# EAGLE design UNO_Shield (EAGLE 9.5.2)
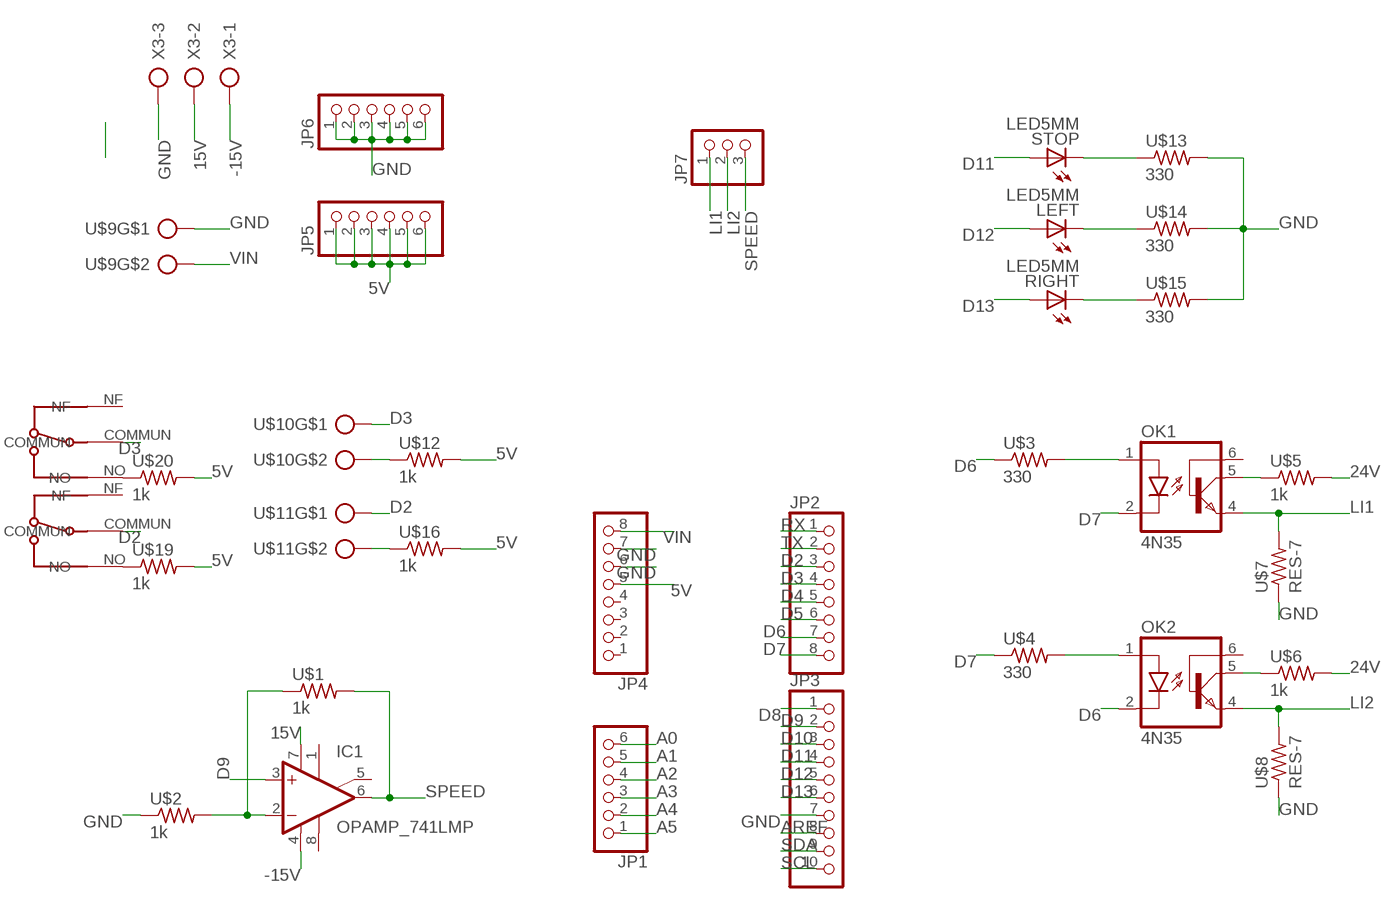
[diagram p0: schematic, sheet 1]

## Parts
IC1  OPAMP_741LMP  [DIL08]
JP1  PINHD-1X6  [1X06]
JP2  PINHD-1X8  [1X08]
JP3  PINHD-1X10  [1X10]
JP4  PINHD-1X8  [1X08]
JP5  PINHD-1X6  [1X06]
JP6  PINHD-1X6  [1X06]
JP7  PINHD-3_DATA  [1X03_DATA]
LEFT  LED5MM  [LED5MM]
OK1  4N35  [DIL06]
OK2  4N35  [DIL06]
RIGHT  LED5MM  [LED5MM]
STOP  LED5MM  [LED5MM]
U$1  1k  RES-7  [0204/7]
U$2  1k  RES-7  [0204/7]
U$3  330  RES-7  [0204/7]
U$4  330  RES-7  [0204/7]
U$5  1k  RES-7  [0204/7]
U$6  1k  RES-7  [0204/7]
U$7  RES-7  [0204/7]
U$8  RES-7  [0204/7]
U$9  CON_PTR_2  [AK300/2]
U$10  CON_PTR_2  [AK300/2]
U$11  CON_PTR_2  [AK300/2]
U$12  1k  RES-7  [0204/7]
U$13  330  RES-7  [0204/7]
U$14  330  RES-7  [0204/7]
U$15  330  RES-7  [0204/7]
U$16  1k  RES-7  [0204/7]
U$17  MICROSWITCHCOUDE  [DG23-B3RA]
U$18  MICROSWITCHCOUDE  [DG23-B3RA]
U$19  1k  RES-7  [0204/7]
U$20  1k  RES-7  [0204/7]
X3  CON_PTR_3  [AK300/3]

## Nets
5V: JP4.5 JP5.1 JP5.2 JP5.3 JP5.4 JP5.5 JP5.6 U$12.2 U$16.2 U$19.2 U$20.2
15V: IC1.7(V+) X3.2
24V: U$5.2 U$6.2
-15V: IC1.4(V-) X3.1
A0: JP1.6
A1: JP1.5
A2: JP1.4
A3: JP1.3
A4: JP1.2
A5: JP1.1
AREF: JP3.8
D2: JP2.3 U$11.1 U$18.COMMUN
D3: JP2.4 U$10.1 U$17.COMMUN
D4: JP2.5
D5: JP2.6
D6: JP2.7 OK1.1(A) OK2.2(C) U$3.1 U$3.2
D7: JP2.8 OK1.2(C) OK2.1(A) U$4.1 U$4.2
D8: JP3.1
D9: IC1.3(+IN) JP3.2
D10: JP3.3
D11: JP3.4 STOP.A
D12: JP3.5 LEFT.A
D13: JP3.6 RIGHT.A
GND: JP3.7 JP4.6 JP4.7 JP6.1 JP6.2 JP6.3 JP6.4 JP6.5 JP6.6 U$2.1 U$7.1 U$8.1 U$9.1 U$13.2 U$14.2 U$15.2 X3.3
LI1: JP7.1 OK1.4(EMI) U$7.2
LI2: JP7.2 OK2.4(EMI) U$8.2
N$1: IC1.2(-IN) U$1.1 U$2.2
N$2: OK1.5(COL) U$5.1
N$3: U$10.2 U$12.1
N$4: STOP.K(C) U$13.1
N$5: U$11.2 U$16.1
N$6: U$18.NO U$19.1
N$7: U$17.NO U$20.1
N$9: LEFT.K(C) U$14.1
N$10: OK2.5(COL) U$6.1
N$11: RIGHT.K(C) U$15.1
RX: JP2.1
SCL: JP3.10
SDA: JP3.9
SPEED: IC1.6(OUT) JP7.3 U$1.2
TX: JP2.2
VIN: JP4.8 U$9.2
Unconnected: IC1.1(ON1) IC1.5(ON2) IC1.8(OPT) JP4.1 JP4.2 JP4.3 JP4.4 OK1.6(BAS) OK2.6(BAS) U$17.NF U$18.NF

## Library data of the parts
IC1 = MIA_LIBRARY-2-2-2:OPAMP_741: OP AMP
JP1 JP5 JP6 = MIA_LIBRARY-2-2-2:PINHD-1X6: PIN HEADER
JP2 JP4 = MIA_LIBRARY-2-2-2:PINHD-1X8: PIN HEADER
JP3 = MIA_LIBRARY-2-2-2:PINHD-1X10: PIN HEADER
JP7 = MIA_LIBRARY-2-2-2:PINHD-3_DATA: PIN HEADER
LEFT RIGHT STOP = MIA_LIBRARY-2-2-2:LED5MM
OK1 OK2 = optocoupler:4N35: MOTOROLA OPTO COUPLER; MF: FAIRCHILD SEMICONDUCTOR; MPN: 4N35; OC_FARNELL: 1328375; OC_NEWARK: 72K9946
U$1-U$8 U$12-U$16 U$19 U$20 = MIA_LIBRARY-2-2-2:RES-7
U$9-U$11 = MIA_LIBRARY-2-2-2:CON_PTR_2
U$17 U$18 = Clean-Kong:MICROSWITCH
X3 = MIA_LIBRARY-2-2-2:CON_PTR_3: CONNECTOR; OC_FARNELL: unknown; OC_NEWARK: unknown

## Board
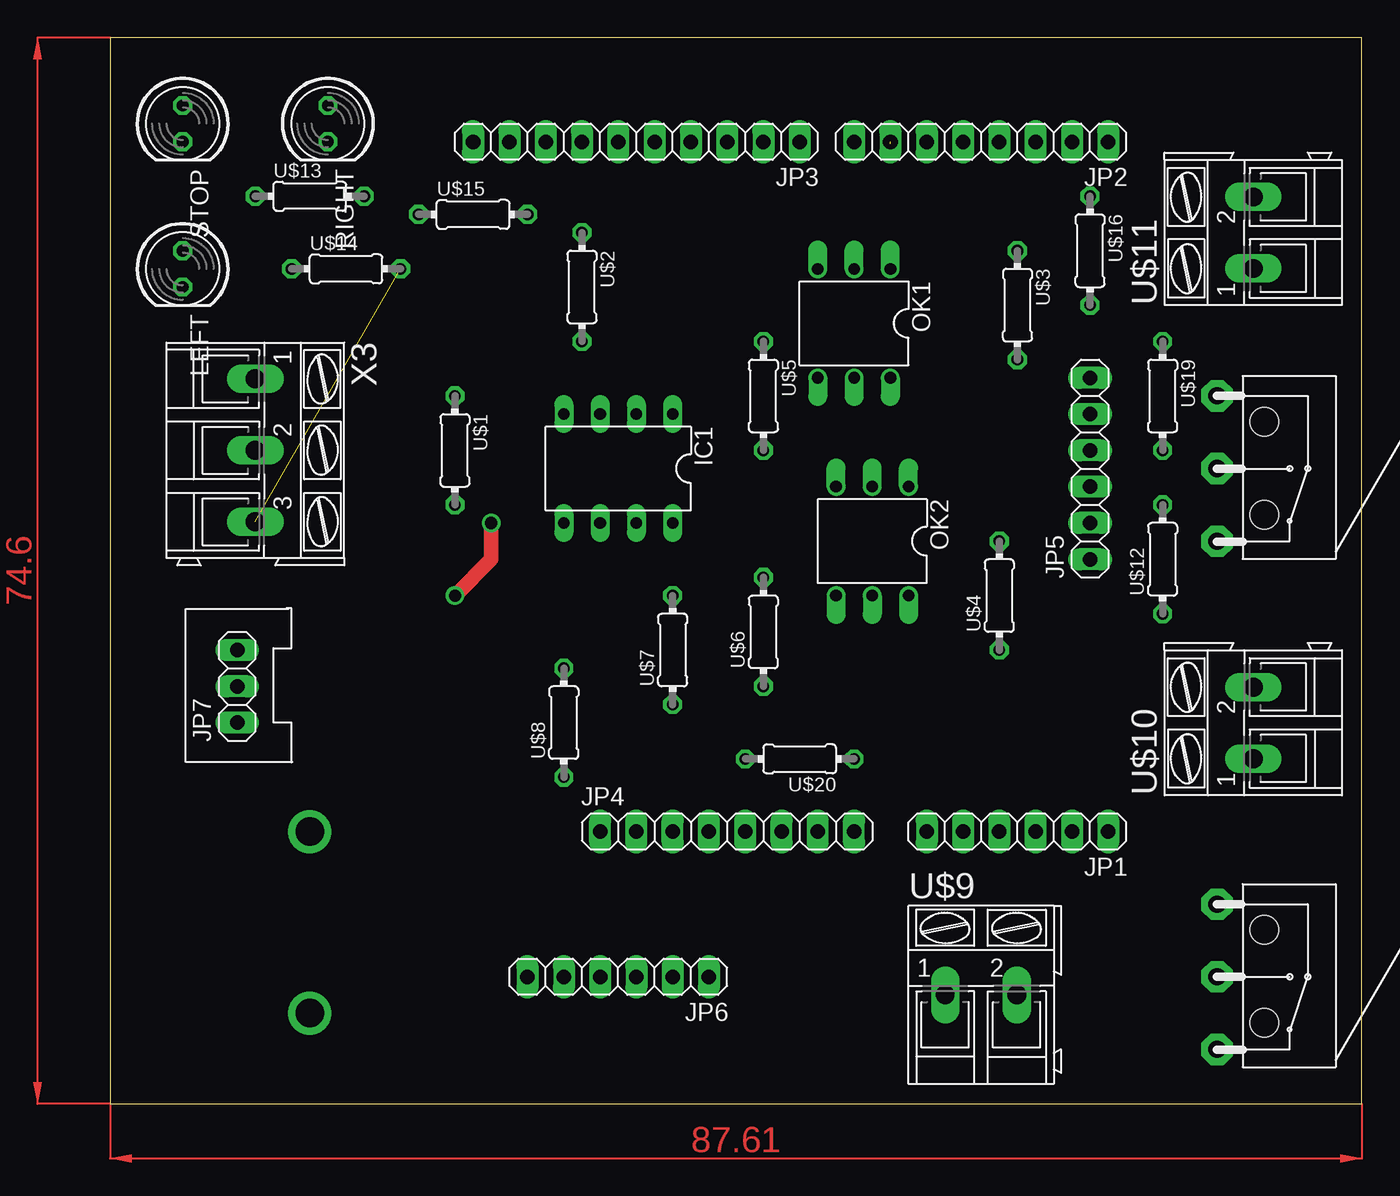
[diagram p1: board, top side]
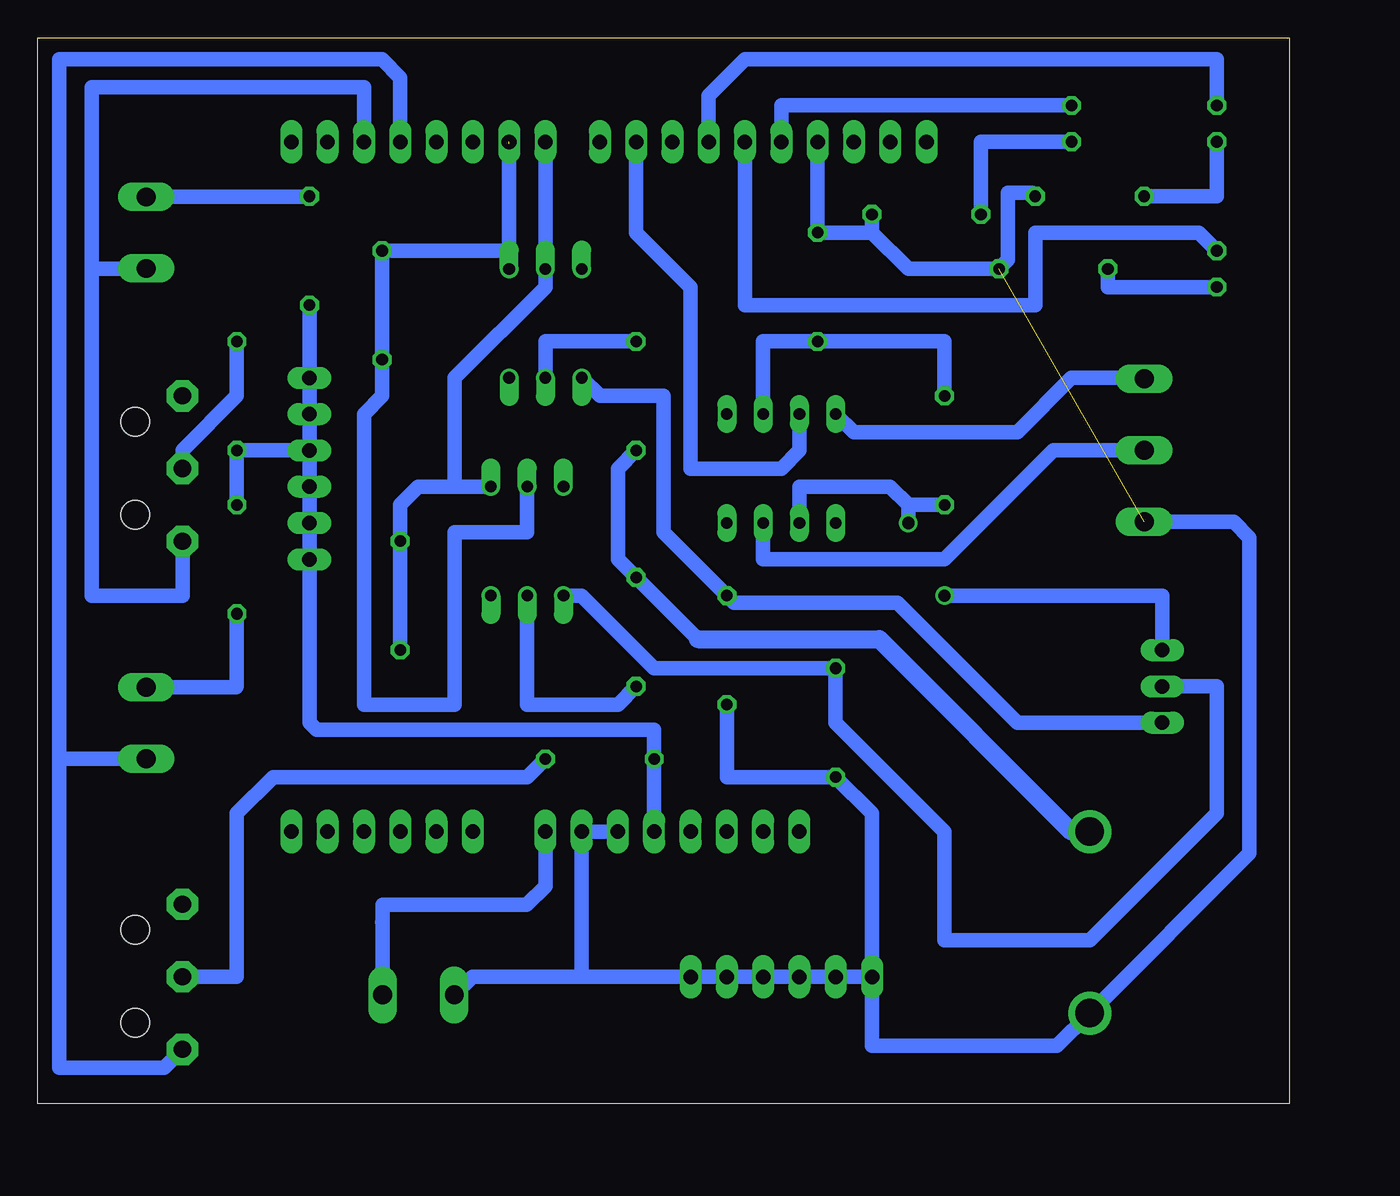
[diagram p2: board, bottom side, seen from below]

Size 87.61 x 74.6 mm. Coordinates in mm from the lower left corner, seen from the top.
Outline: 0,0 87.61,0 87.61,74.6 0,74.6 0,0
Copper layers (1*16): Top 0.035mm / dielectric 1.5mm / Bottom 0.035mm
Design rules "default": minimum track width 6mil, minimum drill 0.35mm, track to track 6mil, track to pad 6mil, pad to pad 6mil, via to via 6mil, smd to smd 6mil, copper to edge 40mil, drill to drill 6mil, minimum pad ring 10mil, minimum via ring 8mil, stop-mask expansion 4mil, vias tented up to drill 0mil, thermal gap 10mil

### Footprints (pad centres in the part's own frame; a part is rotated, then mirrored left to right if it is on the bottom)
DIL08 = drill 0.813 long: 1 -3.81,-3.81; 2 -1.27,-3.81; 3 1.27,-3.81; 4 3.81,-3.81; 5 3.81,3.81; 6 1.27,3.81; 7 -1.27,3.81; 8 -3.81,3.81
1X06 = drill 1.016 long: 1 -6.35,0; 2 -3.81,0; 3 -1.27,0; 4 1.27,0; 5 3.81,0; 6 6.35,0
1X08 = drill 1.016 long: 1 -8.89,0; 2 -6.35,0; 3 -3.81,0; 4 -1.27,0; 5 1.27,0; 6 3.81,0; 7 6.35,0; 8 8.89,0
1X10 = drill 1.016 long: 1 -11.43,0; 2 -8.89,0; 3 -6.35,0; 4 -3.81,0; 5 -1.27,0; 6 1.27,0; 7 3.81,0; 8 6.35,0; 9 8.89,0; 10 11.43,0
1X03_DATA = drill 1.016 long: 1 -2.54,0; 2 0,0; 3 2.54,0
LED5MM = drill 0.813 octagon: A -1.27,0; K 1.27,0
DIL06 = drill 0.813 offset: 1 -2.54,-3.81; 2 0,-3.81; 3 2.54,-3.81; 4 2.54,3.81; 5 0,3.81; 6 -2.54,3.81
0204/7 = drill 0.813 octagon: 1 -3.81,0; 2 3.81,0
AK300/2 = drill 1.321 long: 1 -2.515,0; 2 2.489,0
DG23-B3RA = drill 1.2 pad 2.184 octagon: COMMUN 10.16,0; NF 0,0; NO 5.08,0 | hole 2: 1.8,3.3; 8.3,3.3
AK300/3 = drill 1.321 long: 1 -5.004,0; 2 0,0; 3 5.004,0

### Placement (x,y rotation side)
IC1  35.56,44.45 180 top
JP1  63.5,19.05 180 top
JP2  60.96,67.31 180 top
JP3  36.83,67.31 180 top
JP4  43.18,19.05 0 top
JP5  68.58,44.45 90 top
JP6  35.56,8.89 180 top
JP7  8.89,29.21 90 top
LEFT  5.08,58.42 270 top
OK1  52.07,54.61 180 top
OK2  53.34,39.37 180 top
RIGHT  15.24,68.58 270 top
STOP  5.08,68.58 270 top
U$1  24.13,45.72 270 top
U$2  33.02,57.15 270 top
U$3  63.5,55.88 270 top
U$4  62.23,35.56 90 top
U$5  45.72,49.53 270 top
U$6  45.72,33.02 90 top
U$7  39.37,31.75 90 top
U$8  31.75,26.67 90 top
U$9  60.96,7.62 0 top
U$10  80.01,26.67 90 top
U$11  80.01,60.96 90 top
U$12  73.66,38.1 90 top
U$13  13.97,63.5 0 top
U$14  16.51,58.42 0 top
U$15  25.4,62.23 0 top
U$16  68.58,59.69 270 top
U$17  77.47,13.97 270 top
U$18  77.47,49.53 270 top
U$19  73.66,49.53 270 top
U$20  48.26,24.13 180 top
X3  10.16,45.72 270 top

### Tracks (layer width: path | path; a pad name or v marks a point on that pad's centre or on a via)
5V
  Bottom 1.016: JP4.5 U$20.2 44.45,26.16 68.07,26.16 68.58,26.67 JP5.1 JP5.2 JP5.3 JP5.4 | U$12.2 U$19.2 JP5.4 | JP5.4 JP5.5 JP5.6 U$16.2
15V
  Bottom 1.016: IC1.7 36.83,38.1 24.13,38.1 16.51,45.72 X3.2
24V  (via drill 2)
  Bottom 1.016: U$5.2 46.99,44.45 46.99,38.1 U$6.2 41.4,32.51
  Bottom 1.27: v13.97,19.05 15.24,19.05 28.7,32.51 41.4,32.51
-15V
  Bottom 1.016: IC1.4 30.48,46.99 19.05,46.99 15.24,50.8 10.24,50.8 X3.1
D2
  Bottom 1.016: U$11.1 80.03,58.42 83.82,58.42 | 83.82,58.42 83.82,71.12 64.77,71.12 JP2.3 | U$18.COMMUN 77.47,35.56 83.82,35.56 83.82,58.42
D3
  Bottom 1.016: JP2.4 62.23,71.81 63.5,73.08 86.09,73.08 86.09,24.13 | 80.03,24.13 U$10.1 86.06,24.15 86.09,24.13 | U$17.COMMUN 78.74,2.54 86.09,2.54 86.09,24.13
D6  (1 unrouted)
  Bottom 1.016: 54.61,67.18 OK1.1 54.61,59.69 U$3.1 U$3.2 63.5,49.53 64.77,48.26 64.77,27.94 58.42,27.94 58.42,40.01 53.34,40.01 OK2.2
D7
  Bottom 1.016: JP2.8 OK1.2 52.07,57.15 58.42,50.8 58.42,43.18 | U$4.1 U$4.2 62.23,41.91 60.96,43.18 58.42,43.18 | 58.42,43.18 OK2.1
D9
  Bottom 1.016: JP3.2 45.72,60.96 41.91,57.15 41.91,44.45 35.56,44.45 34.29,45.72 IC1.3
D11
  Bottom 1.016: JP3.4 40.64,70.54 38.1,73.08 5.08,73.08 STOP.A
D12
  Bottom 1.016: LEFT.A 6.35,60.96 17.78,60.96 17.78,55.88 38.1,55.88 JP3.5
D13
  Bottom 1.016: JP3.6 35.56,69.85 RIGHT.A
GND  (via drill 2)  (1 unrouted)
  Bottom 1.016: U$7.1 39.37,22.86 U$8.1 29.21,20.32 JP6.6 | JP3.7 U$2.1 29.21,60.96 | U$9.1 57.18,8.89 49.53,8.89 | 49.53,8.89 JP6.1 JP6.2 JP6.3 JP6.4 JP6.5 JP6.6 | 29.21,60.96 U$15.2 | 29.21,60.96 26.67,58.42 U$14.2 19.69,59.05 19.69,63.75 18.03,63.75 U$13.2 | JP6.6 29.21,4.06 16.26,4.06 v13.97,6.35 2.79,17.53 2.79,39.62 3.89,40.72 X3.3 | JP4.6 JP4.7 49.53,8.89
LI1
  Bottom 1.016: OK1.4 48.26,49.53 43.81,49.53 43.81,40.01 U$7.2 38.86,35.05 27.43,35.05 19.05,26.67 JP7.1
LI2
  Bottom 1.016: OK2.4 49.53,35.56 44.45,30.48 U$8.2 31.75,26.67 24.13,19.05 24.13,11.43 13.97,11.43 5.08,20.32 5.08,29.21 JP7.2
N$1
  Bottom 1.016: U$1.1 24.13,53.34 U$2.2 36.83,53.34 IC1.2
N$2
  Bottom 1.016: OK1.5 52.07,53.34 U$5.1
N$3
  Bottom 1.016: 80.06,29.21 U$10.2 73.71,29.16 73.66,29.21 U$12.1
N$4
  Bottom 1.016: STOP.K 5.08,63.5 U$13.1
N$5
  Bottom 1.016: U$11.2 68.63,63.45 U$16.1
N$6
  Bottom 1.016: U$18.NO 77.47,45.72 73.66,49.53 U$19.1
N$7
  Bottom 1.016: U$20.1 53.34,22.86 71.12,22.86 73.66,20.32 73.66,8.89 U$17.NO
N$9
  Bottom 1.016: U$14.1 12.7,57.15 LEFT.K
N$10
  Bottom 1.016: U$6.1 46.99,27.94 53.34,27.94 OK2.5
N$11
  Bottom 1.016: U$15.1 21.59,67.31 RIGHT.K
SPEED  (via drill 0.85)
  Top 1.016: v26.67,40.64 26.67,38.1 v24.13,35.56
  Bottom 1.016: 26.67,41.91 27.94,43.18 34.29,43.18 IC1.6 | U$1.2 26.67,41.91 | 26.67,41.91 v26.67,40.64 | v24.13,35.56 8.89,35.56 JP7.3
VIN
  Bottom 1.016: U$9.2 63.45,12.65 | 63.45,12.65 63.45,13.92 53.39,13.92 52.07,15.24 JP4.8 | 63.45,12.65 63.5,12.7
(copper drawn outside any net)
  shapes: Top area x2